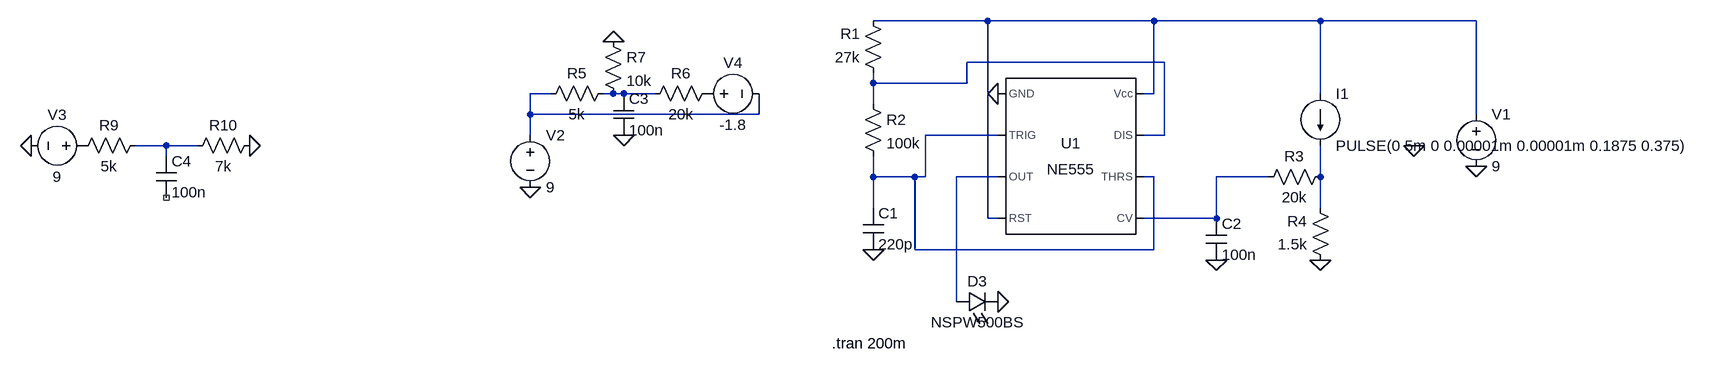
[diagram p0: schematic LTmodel.asc.asc]
LTmodel.asc.asc, the LTspice schematic file:
Version 4
SHEET 1 1512 680
WIRE 352 -288 176 -288
WIRE 608 -288 352 -288
WIRE 864 -288 608 -288
WIRE 1104 -288 864 -288
WIRE 624 -224 320 -224
WIRE 176 -192 176 -208
WIRE 320 -192 320 -224
WIRE 320 -192 176 -192
WIRE -320 -176 -352 -176
WIRE -224 -176 -240 -176
WIRE -208 -176 -224 -176
WIRE -160 -176 -208 -176
WIRE 608 -176 608 -288
WIRE 608 -176 592 -176
WIRE 864 -176 864 -288
WIRE 176 -160 176 -192
WIRE -352 -144 -352 -176
WIRE 0 -144 0 -176
WIRE 0 -144 -352 -144
WIRE 1104 -144 1104 -288
WIRE -352 -112 -352 -144
WIRE 368 -112 256 -112
WIRE 624 -112 624 -224
WIRE 624 -112 592 -112
WIRE -912 -96 -960 -96
WIRE -864 -96 -912 -96
WIRE -912 -80 -912 -96
WIRE 176 -48 176 -80
WIRE 240 -48 176 -48
WIRE 256 -48 256 -112
WIRE 256 -48 240 -48
WIRE 368 -48 304 -48
WIRE 608 -48 592 -48
WIRE 784 -48 704 -48
WIRE 864 -48 864 -96
WIRE 176 0 176 -48
WIRE 864 0 864 -48
WIRE 352 16 352 -288
WIRE 368 16 352 16
WIRE 704 16 704 -48
WIRE 704 16 592 16
WIRE 240 64 240 -48
WIRE 608 64 608 -48
WIRE 608 64 240 64
WIRE 304 144 304 -48
FLAG 864 80 0
FLAG 704 80 0
FLAG 176 64 0
FLAG 368 -176 0
FLAG 1008 -96 0
FLAG 1104 -64 0
FLAG 368 144 0
FLAG -352 -32 0
FLAG -208 -112 0
FLAG -224 -256 0
FLAG -784 -96 0
FLAG -1120 -96 0
SYMBOL res 192 -192 R180
WINDOW 0 36 76 Left 2
WINDOW 3 36 40 Left 2
SYMATTR InstName R1
SYMATTR Value 27k
SYMBOL res 160 -176 R0
SYMATTR InstName R2
SYMATTR Value 100k
SYMBOL cap 160 0 R0
SYMATTR InstName C1
SYMATTR Value 220p
SYMBOL res 880 -64 R90
WINDOW 0 0 56 VBottom 2
WINDOW 3 32 56 VTop 2
SYMATTR InstName R3
SYMATTR Value 20k
SYMBOL res 880 96 R180
WINDOW 0 36 76 Left 2
WINDOW 3 36 40 Left 2
SYMATTR InstName R4
SYMATTR Value 1.5k
SYMBOL Misc\\NE555 480 -80 R0
SYMATTR InstName U1
SYMBOL LED 304 160 R270
WINDOW 0 32 32 VTop 2
WINDOW 3 0 32 VBottom 2
SYMATTR InstName D3
SYMATTR Value NSPW500BS
SYMATTR Description Diode
SYMATTR Type diode
SYMBOL voltage 1104 -160 R0
WINDOW 123 0 0 Left 0
WINDOW 39 0 0 Left 0
SYMATTR InstName V1
SYMATTR Value 9
SYMBOL cap 688 16 R0
SYMATTR InstName C2
SYMATTR Value 100n
SYMBOL current 864 -176 R0
WINDOW 123 0 0 Left 0
WINDOW 39 0 0 Left 0
SYMATTR InstName I1
SYMATTR Value PULSE(0 5m 0 0.00001m 0.00001m 0.1875 0.375)
SYMBOL voltage -352 -128 R0
WINDOW 123 0 0 Left 0
WINDOW 39 0 0 Left 0
SYMATTR InstName V2
SYMATTR Value 9
SYMBOL res -224 -192 R90
WINDOW 0 0 56 VBottom 2
WINDOW 3 32 56 VTop 2
SYMATTR InstName R5
SYMATTR Value 5k
SYMBOL res -64 -192 R90
WINDOW 0 0 56 VBottom 2
WINDOW 3 32 56 VTop 2
SYMATTR InstName R6
SYMATTR Value 20k
SYMBOL cap -224 -176 R0
SYMATTR InstName C3
SYMATTR Value 100n
SYMBOL res -240 -272 R0
SYMATTR InstName R7
SYMATTR Value 10k
SYMBOL res -944 -112 R90
WINDOW 0 0 56 VBottom 2
WINDOW 3 32 56 VTop 2
SYMATTR InstName R9
SYMATTR Value 5k
SYMBOL res -768 -112 R90
WINDOW 0 0 56 VBottom 2
WINDOW 3 32 56 VTop 2
SYMATTR InstName R10
SYMATTR Value 7k
SYMBOL cap -928 -80 R0
SYMATTR InstName C4
SYMATTR Value 100n
SYMBOL voltage -1024 -96 R90
WINDOW 0 -32 56 VBottom 2
WINDOW 3 32 56 VTop 2
WINDOW 123 0 0 Left 0
WINDOW 39 0 0 Left 0
SYMATTR InstName V3
SYMATTR Value 9
SYMBOL voltage -96 -176 R270
WINDOW 0 32 56 VTop 2
WINDOW 3 -32 56 VBottom 2
WINDOW 123 0 0 Left 0
WINDOW 39 0 0 Left 0
SYMATTR InstName V4
SYMATTR Value -1.8
TEXT 112 208 Left 2 !.tran 200m
LINE Normal 864 -128 864 -128 2

The netlist it stands for:
* LTmodel.asc.asc
R1 N002 N001 27k
R2 N002 N005 100k
C1 N005 0 220p
R3 N009 N008 20k
R4 0 N009 1.5k
XU1 0 N005 N007 N001 N008 N005 N002 N001 NE555  ; pins GND TRIG OUT RST CV THRS DIS Vcc
D3 N007 0 NSPW500BS
V1 N001 0 9
C2 N008 0 100n
I1 N001 N009 PULSE(0 5m 0 0.00001m 0.00001m 0.1875 0.375)
V2 N003 0 9
R5 N004 N003 5k
R6 P001 N004 20k
C3 N004 0 100n
R7 0 N004 10k
R9 N006 P002 5k
R10 0 N006 7k
C4 N006 NC_01 100n
V3 P002 0 9
V4 P001 N003 -1.8
.model D D
.lib standard.dio
.tran 200m
.lib NE555.sub
.backanno
.end